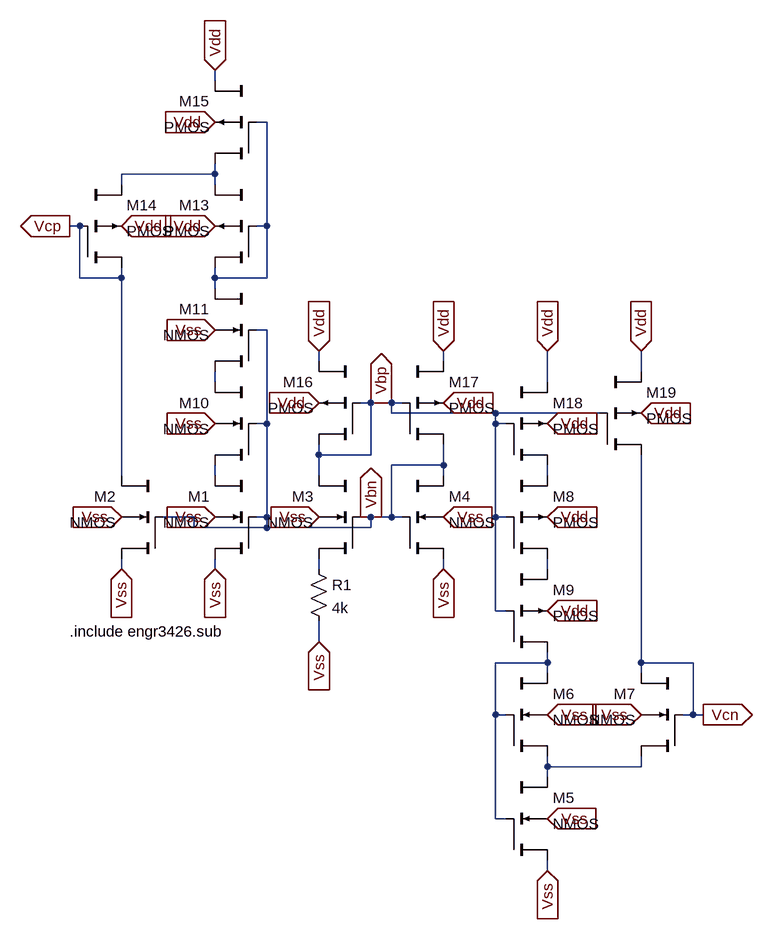
[diagram p0: schematic bias.asc]
bias.asc, the LTspice schematic file:
Version 4
SHEET 1 1492 748
WIRE -256 -592 -256 -608
WIRE -176 -528 -192 -528
WIRE -256 -448 -256 -464
WIRE -256 -448 -400 -448
WIRE -400 -432 -400 -448
WIRE -256 -432 -256 -448
WIRE -464 -368 -480 -368
WIRE -176 -368 -176 -528
WIRE -176 -368 -192 -368
WIRE -464 -288 -464 -368
WIRE -400 -288 -400 -304
WIRE -400 -288 -464 -288
WIRE -256 -288 -256 -304
WIRE -176 -288 -176 -368
WIRE -176 -288 -256 -288
WIRE -256 -272 -256 -288
WIRE -176 -208 -192 -208
WIRE -96 -160 -96 -176
WIRE 96 -160 96 -176
WIRE 400 -144 400 -176
WIRE -256 -128 -256 -144
WIRE 256 -128 256 -176
WIRE -16 -96 -32 -96
WIRE 0 -96 -16 -96
WIRE 16 -96 0 -96
WIRE 32 -96 16 -96
WIRE 16 -80 16 -96
WIRE 176 -80 16 -80
WIRE 336 -80 176 -80
WIRE -176 -64 -176 -208
WIRE -176 -64 -192 -64
WIRE 176 -64 176 -80
WIRE 192 -64 176 -64
WIRE -96 -16 -96 -32
WIRE -16 -16 -16 -96
WIRE -16 -16 -96 -16
WIRE 96 0 96 -32
WIRE 96 0 16 0
WIRE -400 16 -400 -288
WIRE -256 16 -256 0
WIRE -96 16 -96 -16
WIRE 96 16 96 0
WIRE 256 16 256 0
WIRE -288 80 -336 80
WIRE -176 80 -176 -64
WIRE -176 80 -192 80
WIRE -16 80 -32 80
WIRE 16 80 16 0
WIRE 16 80 -16 80
WIRE 32 80 16 80
WIRE 176 80 176 -64
WIRE 192 80 176 80
WIRE -288 96 -288 80
WIRE -176 96 -176 80
WIRE -176 96 -288 96
WIRE -16 96 -16 80
WIRE -16 96 -176 96
WIRE -400 160 -400 144
WIRE -256 160 -256 144
WIRE -96 160 -96 144
WIRE 96 160 96 144
WIRE 256 160 256 144
WIRE 176 224 176 80
WIRE 192 224 176 224
WIRE -96 272 -96 240
WIRE 256 304 256 288
WIRE 256 304 176 304
WIRE 400 304 400 -16
WIRE 480 304 400 304
WIRE 256 320 256 304
WIRE 400 320 400 304
WIRE 176 384 176 304
WIRE 192 384 176 384
WIRE 480 384 480 304
WIRE 480 384 464 384
WIRE 496 384 480 384
WIRE 256 464 256 448
WIRE 400 464 400 448
WIRE 400 464 256 464
WIRE 256 480 256 464
WIRE 176 544 176 384
WIRE 192 544 176 544
WIRE 256 624 256 608
FLAG 0 -96 Vbp
IOPIN 0 -96 Out
FLAG -16 80 Vbn
IOPIN -16 80 Out
FLAG -400 160 Vss
IOPIN -400 160 In
FLAG -400 80 Vss
IOPIN -400 80 In
FLAG -256 80 Vss
IOPIN -256 80 In
FLAG -256 160 Vss
IOPIN -256 160 In
FLAG -96 80 Vss
IOPIN -96 80 In
FLAG 96 80 Vss
IOPIN 96 80 In
FLAG 96 160 Vss
IOPIN 96 160 In
FLAG 256 624 Vss
IOPIN 256 624 In
FLAG 256 544 Vss
IOPIN 256 544 In
FLAG 400 384 Vss
IOPIN 400 384 In
FLAG 256 384 Vss
IOPIN 256 384 In
FLAG -96 -96 Vdd
IOPIN -96 -96 In
FLAG -256 -368 Vdd
IOPIN -256 -368 In
FLAG -400 -368 Vdd
IOPIN -400 -368 In
FLAG -256 -528 Vdd
IOPIN -256 -528 In
FLAG -96 -176 Vdd
IOPIN -96 -176 In
FLAG 96 -176 Vdd
IOPIN 96 -176 In
FLAG 256 -176 Vdd
IOPIN 256 -176 In
FLAG 400 -176 Vdd
IOPIN 400 -176 In
FLAG 400 -80 Vdd
IOPIN 400 -80 In
FLAG 256 -64 Vdd
IOPIN 256 -64 In
FLAG 96 -96 Vdd
IOPIN 96 -96 In
FLAG -256 -608 Vdd
IOPIN -256 -608 In
FLAG 496 384 Vcn
IOPIN 496 384 Out
FLAG -480 -368 Vcp
IOPIN -480 -368 Out
FLAG 256 80 Vdd
IOPIN 256 80 In
FLAG 256 224 Vdd
IOPIN 256 224 In
FLAG -256 -64 Vss
IOPIN -256 -64 In
FLAG -256 -208 Vss
IOPIN -256 -208 In
FLAG -96 272 Vss
IOPIN -96 272 In
SYMBOL cktsym\\nmos4 -256 80 M0
SYMATTR InstName M1
SYMATTR Value2 l=1.8u w=36u
SYMBOL cktsym\\nmos4 -400 80 M0
SYMATTR InstName M2
SYMATTR Value2 l=1.8u w=36u
SYMBOL cktsym\\nmos4 -96 80 M0
SYMATTR InstName M3
SYMATTR Value2 l=1.8u w=72u
SYMBOL cktsym\\nmos4 96 80 R0
SYMATTR InstName M4
SYMATTR Value2 l=1.8u w=36u
SYMBOL cktsym\\nmos4 256 544 R0
SYMATTR InstName M5
SYMATTR Value2 l=1.8u w=36u
SYMBOL cktsym\\nmos4 256 384 R0
SYMATTR InstName M6
SYMATTR Value2 l=1.8u w=36u m=2
SYMBOL cktsym\\nmos4 400 384 M0
SYMATTR InstName M7
SYMATTR Value2 l=1.8u w=36u
SYMBOL cktsym\\pmos4 -256 -368 M0
SYMATTR InstName M13
SYMATTR Value2 l=1.8u w=36u m=2
SYMBOL cktsym\\pmos4 -400 -368 R0
SYMATTR InstName M14
SYMATTR Value2 l=1.8u w=36u
SYMBOL cktsym\\pmos4 -256 -528 M0
SYMATTR InstName M15
SYMATTR Value2 l=1.8u w=36u
SYMBOL cktsym\\pmos4 -96 -96 M0
SYMATTR InstName M16
SYMATTR Value2 l=1.8u w=36u
SYMBOL cktsym\\pmos4 96 -96 R0
SYMATTR InstName M17
SYMATTR Value2 l=1.8u w=36u
SYMBOL cktsym\\pmos4 256 -64 R0
SYMATTR InstName M18
SYMATTR Value2 l=1.8u w=36u
SYMBOL cktsym\\pmos4 400 -80 R0
SYMATTR InstName M19
SYMATTR Value2 l=1.8u w=36u
SYMBOL cktsym\\pmos4 256 80 R0
SYMATTR InstName M8
SYMATTR Value2 l=1.8u w=36u
SYMBOL cktsym\\pmos4 256 224 R0
SYMATTR InstName M9
SYMATTR Value2 l=1.8u w=36u
SYMBOL cktsym\\nmos4 -256 -64 M0
SYMATTR InstName M10
SYMATTR Value2 l=1.8u w=36u
SYMBOL cktsym\\nmos4 -256 -208 M0
SYMATTR InstName M11
SYMATTR Value2 l=1.8u w=36u
SYMBOL res -112 144 R0
SYMATTR InstName R1
SYMATTR Value 4k
TEXT -480 256 Left 2 !.include engr3426.sub

The netlist it stands for:
* bias.asc
M1 N004 Vbn Vss Vss NMOS l=1.8u w=36u
M2 Vcp Vbn Vss Vss NMOS l=1.8u w=36u
M3 Vbp Vbn N006 Vss NMOS l=1.8u w=72u
M4 Vbn Vbn Vss Vss NMOS l=1.8u w=36u
M5 N009 N008 Vss Vss NMOS l=1.8u w=36u
M6 N008 N008 N009 Vss NMOS l=1.8u w=36u m=2
M7 Vcn Vcn N009 Vss NMOS l=1.8u w=36u
M13 N001 N001 N002 Vdd PMOS l=1.8u w=36u m=2
M14 Vcp Vcp N002 Vdd PMOS l=1.8u w=36u
M15 N002 N001 Vdd Vdd PMOS l=1.8u w=36u
M16 Vbp Vbp Vdd Vdd PMOS l=1.8u w=36u
M17 Vbn Vbp Vdd Vdd PMOS l=1.8u w=36u
M18 N005 Vbp Vdd Vdd PMOS l=1.8u w=36u
M19 Vcn Vbp Vdd Vdd PMOS l=1.8u w=36u
M8 N007 Vbp N005 Vdd PMOS l=1.8u w=36u
M9 N008 Vbp N007 Vdd PMOS l=1.8u w=36u
M10 N003 Vbn N004 Vss NMOS l=1.8u w=36u
M11 N001 Vbn N003 Vss NMOS l=1.8u w=36u
R1 N006 Vss 4k
.model NMOS NMOS
.model PMOS PMOS
.lib standard.mos
.include engr3426.sub
.backanno
.end